# Altium schematic sheet 04_IC_CONTROL.SchDoc
size A; SheetNumber: 5; SheetTotal: 6
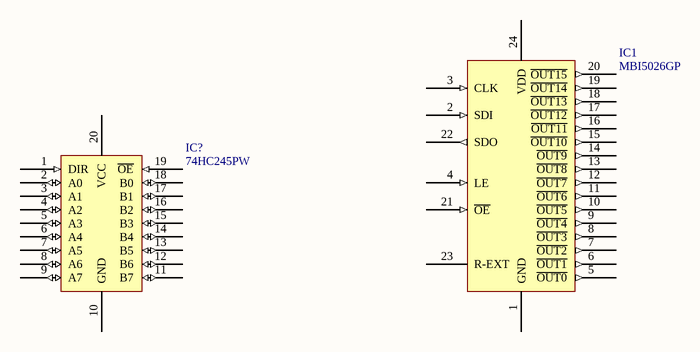
[diagram p0: 04_IC_CONTROL.SchDoc]

## Parts
IC1  MBI5026GP  [MBI5026GP]
IC?  74HC245PW  [20-TSSOP]

## Nets

Not connected (* = marked no-connect by the designer): IC1 1(GND) 2(SDI) 3(CLK) 4(LE) 5(~{OUT0}) 6(~{OUT1}) 7(~{OUT2}) 8(~{OUT3}) 9(~{OUT4}) 10(~{OUT5}) 11(~{OUT6}) 12(~{OUT7}) 13(~{OUT8}) 14(~{OUT9}) 15(~{OUT10}) 16(~{OUT11}) 17(~{OUT12}) 18(~{OUT13}) 19(~{OUT14}) 20(~{OUT15}) 21(~{OE}) 22(SDO) 23(R-EXT) 24(VDD); IC? 1(DIR) 2(A0) 3(A1) 4(A2) 5(A3) 6(A4) 7(A5) 8(A6) 9(A7) 10(GND) 11(B7) 12(B6) 13(B5) 14(B4) 15(B3) 16(B2) 17(B1) 18(B0) 19(~{OE}) 20(VCC)

## Library data of the parts
IC1 = MBI5026GP: 16-bit Constant Current LED Sink Driver
IC? = 74HC245PW: Octal bus transceiver; 3-state; Mfr: NXP USA Inc.; Logic Type: Transceiver, Non-Inverting; Number of Elements: 1; Number of Bits per Element: 8; Current - Output High, Low: 7.8mA, 7.8mA; Voltage - Supply: 2V ~ 6V; Output Type: 3-State; Operating Temperature: -40°C ~ 125°C (TA); Mounting Type: Surface Mount; Package / Case: 20-TSSOP (0.173", 4.40mm Width)